# Altium schematic sheet Optical Compressor V2.SchDoc (part 1 of 2)
size A2; SheetNumber: 1; SheetTotal: 1
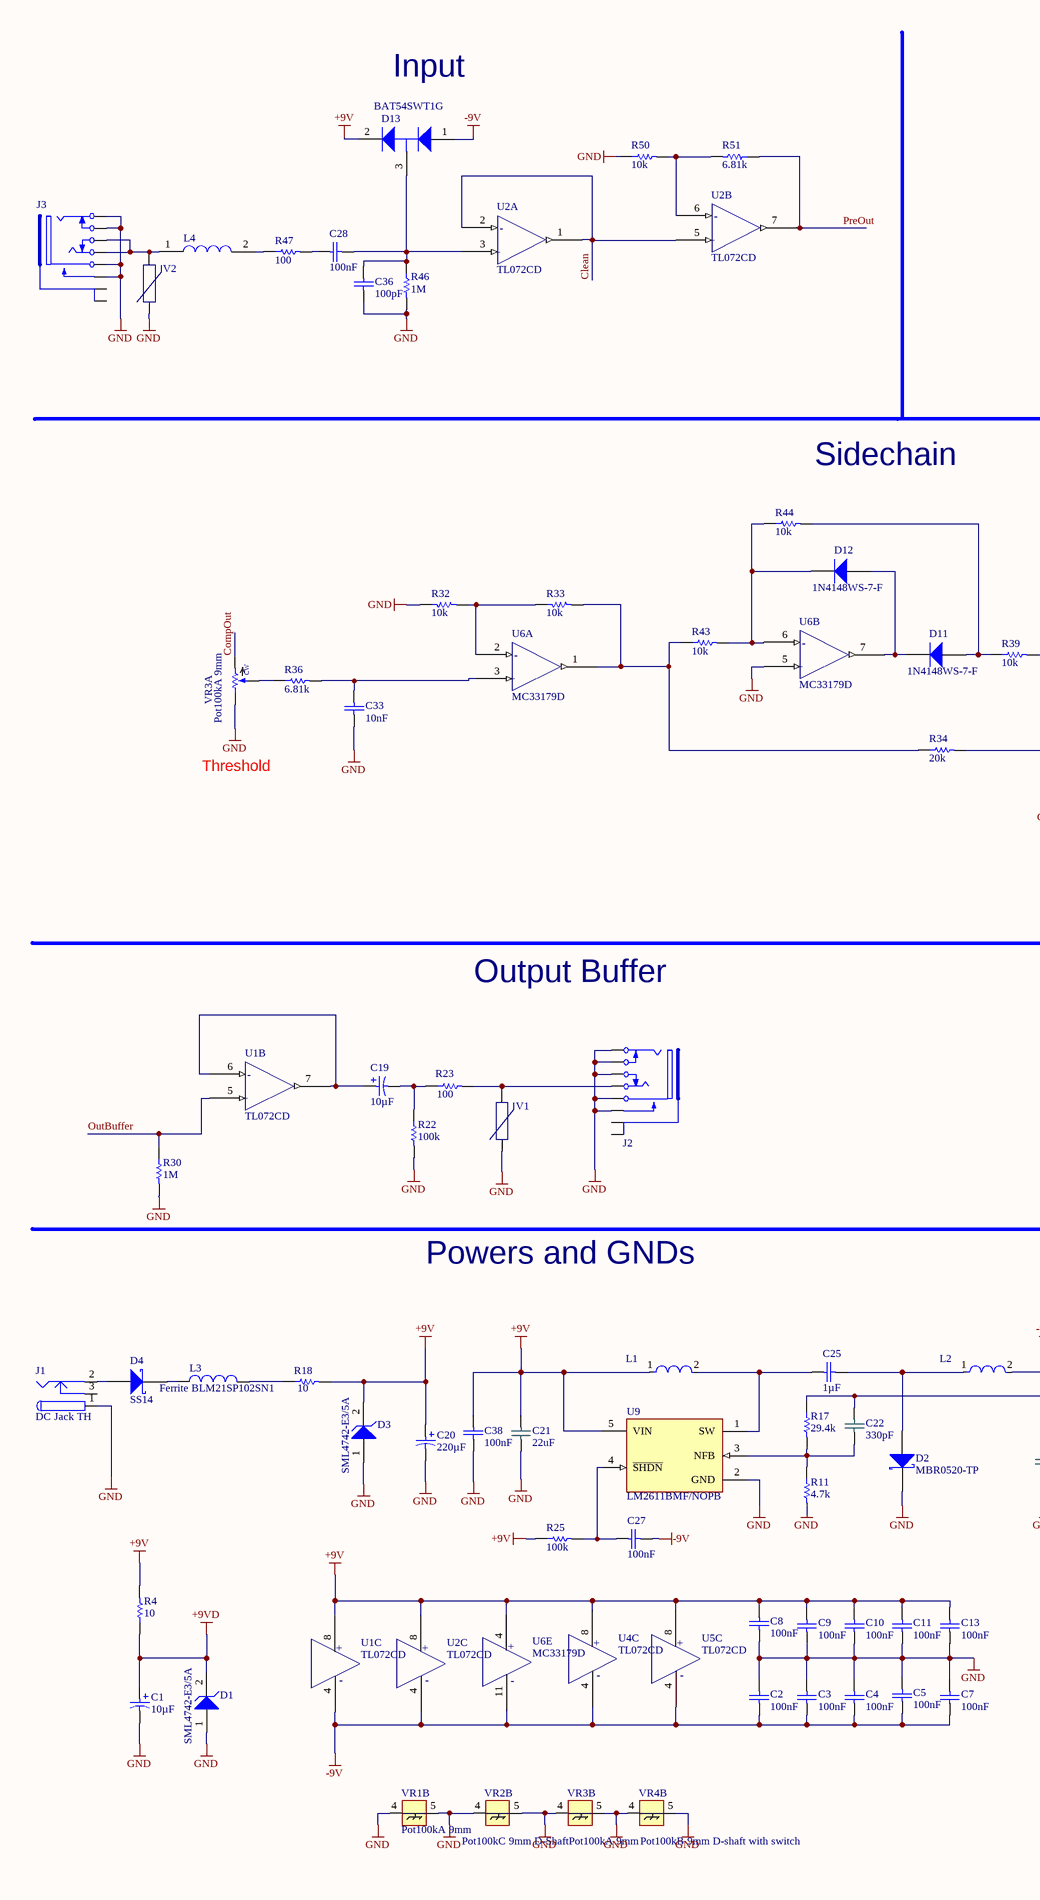
[diagram p0: Optical Compressor V2.SchDoc, left]
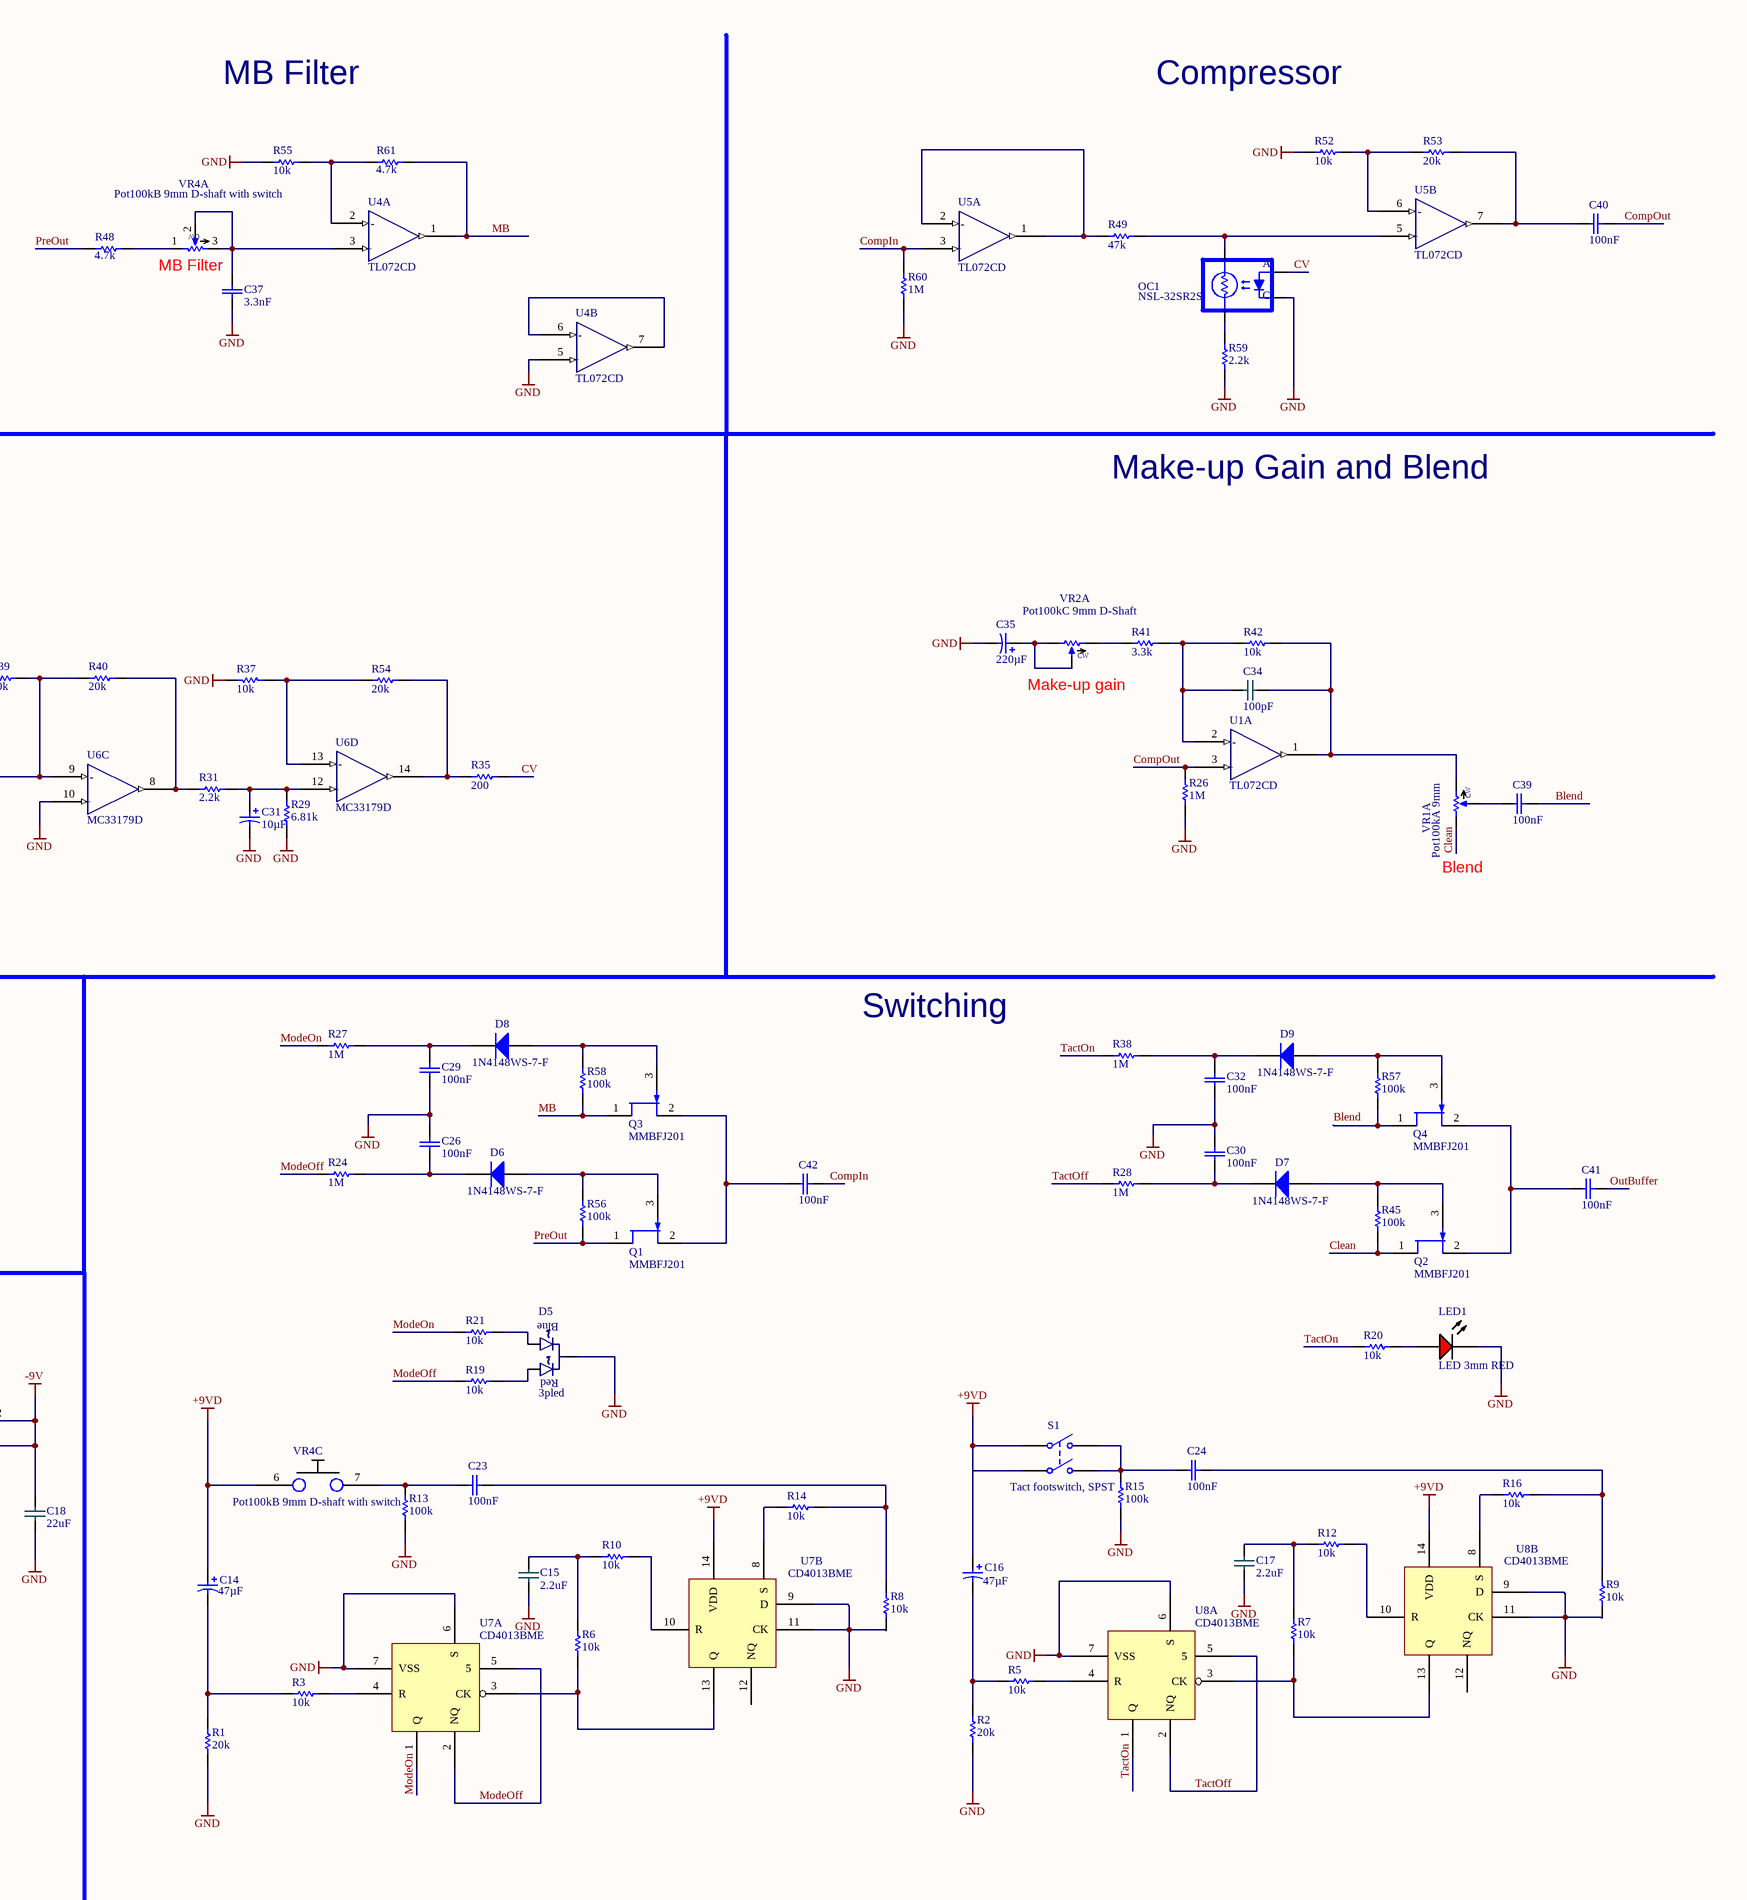
[diagram p1: Optical Compressor V2.SchDoc, right]

## Parts
C1  Capacitance: 10µF  [E-CAP, SMT, diameter 5mm, height 5.4mm]  (hidden comment: Cap pol 10µF 35V)
C2  Capacitance: 100nF  [0603-CAP]  (hidden comment: Cap 100nF 0603 X7R)
C3  Capacitance: 100nF  [0603-CAP]  (hidden comment: Cap 100nF 0603 X7R)
C4  Capacitance: 100nF  [0603-CAP]  (hidden comment: Cap 100nF 0603 X7R)
C5  Capacitance: 100nF  [0603-CAP]  (hidden comment: Cap 100nF 0603 X7R)
C7  Capacitance: 100nF  [0603-CAP]  (hidden comment: Cap 100nF 0603 X7R)
C8  Capacitance: 100nF  [0603-CAP]  (hidden comment: Cap 100nF 0603 X7R)
C9  Capacitance: 100nF  [0603-CAP]  (hidden comment: Cap 100nF 0603 X7R)
C10  Capacitance: 100nF  [0603-CAP]  (hidden comment: Cap 100nF 0603 X7R)
C11  Capacitance: 100nF  [0603-CAP]  (hidden comment: Cap 100nF 0603 X7R)
C13  Capacitance: 100nF  [0603-CAP]  (hidden comment: Cap 100nF 0603 X7R)
C14  Capacitance: 47µF  [E-CAP, SMT, diameter 6.3mm, height 5.4mm]  (hidden comment: Cap pol 47µF 16V)
C15  Capacitance: 2.2uF  [0805-CAP]  (hidden comment: Cap 0805 2.2uF)
C16  Capacitance: 47µF  [E-CAP, SMT, diameter 6.3mm, height 5.4mm]  (hidden comment: Cap pol 47µF 16V)
C17  Capacitance: 2.2uF  [0805-CAP]  (hidden comment: Cap 0805 2.2uF)
C18  value 22uF  [0805-CAP]  (hidden comment: Cap 0805 22uF)
C19  Capacitance: 10µF  [E-CAP, SMT, diameter 5mm, height 5.4mm]  (hidden comment: Cap pol 10µF 35V)
C20  Capacitance: 220µF  [E-CAP, SMT, diameter 6.3mm, height 7.7mm]  (hidden comment: Cap pol 220µF 16V)
C21  value 22uF  [0805-CAP]  (hidden comment: Cap 0805 22uF)
C22  value 330pF  [0603-CAP]  (hidden comment: Cap 0603 330pF)
C23  Capacitance: 100nF  [0603-CAP]  (hidden comment: Cap 100nF 0603 X7R)
C24  Capacitance: 100nF  [0603-CAP]  (hidden comment: Cap 100nF 0603 X7R)
C25  Capacitance: 1µF  [0805-CAP]  (hidden comment: Cap 1µF 0805 X7R)
C26  Capacitance: 100nF  [0603-CAP]  (hidden comment: Cap 100nF 0603 X7R)
C27  Capacitance: 100nF  [0603-CAP]  (hidden comment: Cap 100nF 0603 X7R)
C28  Capacitance: 100nF  [1206-CAP]  (hidden comment: Cap 100nF 1206 C0G)
C29  Capacitance: 100nF  [0603-CAP]  (hidden comment: Cap 100nF 0603 X7R)
C30  Capacitance: 100nF  [0603-CAP]  (hidden comment: Cap 100nF 0603 X7R)
C31  Capacitance: 10µF  [E-CAP, SMT, diameter 5mm, height 5.4mm]  (hidden comment: Cap pol 10µF 35V)
C32  Capacitance: 100nF  [0603-CAP]  (hidden comment: Cap 100nF 0603 X7R)
C33  Capacitance: 10nF  [0603-CAP]  (hidden comment: Cap 10nF 0603 C0G)
C34  Capacitance: 100pF  [0603-CAP]  (hidden comment: Cap 0603 100pF)
C35  Capacitance: 220µF  [E-CAP, SMT, diameter 6.3mm, height 7.7mm]  (hidden comment: Cap pol 220µF 16V)
C36  Capacitance: 100pF  [0603-CAP]  (hidden comment: Cap 100pF 0603 C0G)
C37  Capacitance: 3.3nF  [0603-CAP]  (hidden comment: Cap 3.3nF 0603 C0G)
C38  Capacitance: 100nF  [0603-CAP]  (hidden comment: Cap 100nF 0603 X7R)
C39  Capacitance: 100nF  [1206-CAP]  (hidden comment: Cap 100nF 1206 C0G)
C40  Capacitance: 100nF  [1206-CAP]  (hidden comment: Cap 100nF 1206 C0G)
C41  Capacitance: 100nF  [1206-CAP]  (hidden comment: Cap 100nF 1206 C0G)
C42  Capacitance: 100nF  [1206-CAP]  (hidden comment: Cap 100nF 1206 C0G)
D1  SML4742-E3/5A  [DO-214AC]
D2  MBR0520-TP  [SODFL370X135-2N]
D3  SML4742-E3/5A  [DO-214AC]
D4  SS14  [SS14]
D5  3pled  [LED DUAL REDBLUE]
D6  1N4148WS-7-F  [1N4148WS-7-F]
D7  1N4148WS-7-F  [1N4148WS-7-F]
D8  1N4148WS-7-F  [1N4148WS-7-F]
D9  1N4148WS-7-F  [1N4148WS-7-F]
D11  1N4148WS-7-F  [1N4148WS-7-F]
D12  1N4148WS-7-F  [1N4148WS-7-F]
D13  BAT54SWT1G  [ONSC-SOT-323-3-419-04_V]
J1  DC Jack TH  [DC_Jack]
J2  Neutrik TRS Jack with metal nut  [Neutrik Jack with Cliff EMI screen]  (value not drawn)
J3  Neutrik TRS Jack with metal nut  [Neutrik Jack with Cliff EMI screen]  (value not drawn)
L1  CR32NP-100KC  [INDC3340X27N]  (value not drawn)
L2  CR32NP-100KC  [INDC3340X27N]  (value not drawn)
L3  Ferrite BLM21SP102SN1  [0805-IND]
L4  MAF1005GAD352A  [0402 COMPONENT]  (value not drawn)
LED1  LED 3mm RED  [KING-WP710A10QBCD_V]
OC1  NSL-32SR2S  [NSL]
Q1  MMBFJ201  [MMBFJ201]
Q2  MMBFJ201  [MMBFJ201]
Q3  MMBFJ201  [MMBFJ201]
Q4  MMBFJ201  [MMBFJ201]
R1  Resistance: 20k  [0603-RES]  (hidden comment: Res 20k 1% 0603)
R2  Resistance: 20k  [0603-RES]  (hidden comment: Res 20k 1% 0603)
R3  Resistance: 10k  [0603-RES]  (hidden comment: Res 10k 1% 0603)
R4  Resistance: 10  [0805-RES]  (hidden comment: Res 10R 5% 0805)
R5  Resistance: 10k  [0603-RES]  (hidden comment: Res 10k 1% 0603)
R6  Resistance: 10k  [0603-RES]  (hidden comment: Res 10k 1% 0603)
R7  Resistance: 10k  [0603-RES]  (hidden comment: Res 10k 1% 0603)
R8  Resistance: 10k  [0603-RES]  (hidden comment: Res 10k 1% 0603)
R9  Resistance: 10k  [0603-RES]  (hidden comment: Res 10k 1% 0603)
R10  Resistance: 10k  [0603-RES]  (hidden comment: Res 10k 1% 0603)
R11  Resistance: 4.7k  [0603-RES]  (hidden comment: Res 4.7k 1% 0603)
R12  Resistance: 10k  [0603-RES]  (hidden comment: Res 10k 1% 0603)
R13  Resistance: 100k  [0603-RES]  (hidden comment: Res 100k 1% 0603)
R14  Resistance: 10k  [0603-RES]  (hidden comment: Res 10k 1% 0603)
R15  Resistance: 100k  [0603-RES]  (hidden comment: Res 100k 1% 0603)
R16  Resistance: 10k  [0603-RES]  (hidden comment: Res 10k 1% 0603)
R17  Resistance: 29.4k  [0805-RES]  (hidden comment: Res 29.4k 1% 0805)
R18  Resistance: 10  [0805-RES]  (hidden comment: Res 10R 5% 0805)
R19  Resistance: 10k  [0603-RES]  (hidden comment: Res 10k 1% 0603)
R20  Resistance: 10k  [0603-RES]  (hidden comment: Res 10k 1% 0603)
R21  Resistance: 10k  [0603-RES]  (hidden comment: Res 10k 1% 0603)
R22  Resistance: 100k  [0603-RES]  (hidden comment: Res 100k 1% 0603)
R23  Resistance: 100  [0805-RES]  (hidden comment: Res 100R 1% 0805)
R24  Resistance: 1M  [0603-RES]  (hidden comment: Res 1M 1% 0603)
R25  Resistance: 100k  [0603-RES]  (hidden comment: Res 100k 1% 0603)
R26  Resistance: 1M  [0603-RES]  (hidden comment: Res 1M 1% 0603)
R27  Resistance: 1M  [0603-RES]  (hidden comment: Res 1M 1% 0603)
R28  Resistance: 1M  [0603-RES]  (hidden comment: Res 1M 1% 0603)
R29  Resistance: 6.81k  [0603-RES]  (hidden comment: Res 6.81k 1% 0603)
R30  Resistance: 1M  [0603-RES]  (hidden comment: Res 1M 1% 0603)
R31  Resistance: 2.2k  [0603-RES]  (hidden comment: Res 2.2k 1% 0603)
R32  Resistance: 10k  [0603-RES]  (hidden comment: Res 10k 1% 0603)
R33  Resistance: 10k  [0603-RES]  (hidden comment: Res 10k 1% 0603)
R34  Resistance: 20k  [0603-RES]  (hidden comment: Res 20k 1% 0603)
R35  Resistance: 200  [0805-RES]  (hidden comment: Res 200R 1% 0805)
R36  Resistance: 6.81k  [0603-RES]  (hidden comment: Res 6.81k 1% 0603)
R37  Resistance: 10k  [0603-RES]  (hidden comment: Res 10k 1% 0603)
R38  Resistance: 1M  [0603-RES]  (hidden comment: Res 1M 1% 0603)
R39  Resistance: 10k  [0603-RES]  (hidden comment: Res 10k 1% 0603)
R40  Resistance: 20k  [0603-RES]  (hidden comment: Res 20k 1% 0603)
R41  Resistance: 3.3k  [0603-RES]  (hidden comment: Res 3.3k 1% 0603)
R42  Resistance: 10k  [0603-RES]  (hidden comment: Res 10k 1% 0603)
R43  Resistance: 10k  [0603-RES]  (hidden comment: Res 10k 1% 0603)
R44  Resistance: 10k  [0603-RES]  (hidden comment: Res 10k 1% 0603)
R45  Resistance: 100k  [0603-RES]  (hidden comment: Res 100k 1% 0603)
R46  Resistance: 1M  [0603-RES]  (hidden comment: Res 1M 1% 0603)
R47  Resistance: 100  [0805-RES]  (hidden comment: Res 100R 1% 0805)
R48  Resistance: 4.7k  [0603-RES]  (hidden comment: Res 4.7k 1% 0603)
R49  Resistance: 47k  [0603-RES]  (hidden comment: Res 47k 1% 0603)
R50  Resistance: 10k  [0603-RES]  (hidden comment: Res 10k 1% 0603)
R51  Resistance: 6.81k  [0603-RES]  (hidden comment: Res 6.81k 1% 0603)
R52  Resistance: 10k  [0603-RES]  (hidden comment: Res 10k 1% 0603)
R53  Resistance: 20k  [0603-RES]  (hidden comment: Res 20k 1% 0603)
R54  Resistance: 20k  [0603-RES]  (hidden comment: Res 20k 1% 0603)
R55  Resistance: 10k  [0603-RES]  (hidden comment: Res 10k 1% 0603)
R56  Resistance: 100k  [0603-RES]  (hidden comment: Res 100k 1% 0603)
R57  Resistance: 100k  [0603-RES]  (hidden comment: Res 100k 1% 0603)
R58  Resistance: 100k  [0603-RES]  (hidden comment: Res 100k 1% 0603)
R59  Resistance: 2.2k  [0603-RES]  (hidden comment: Res 2.2k 1% 0603)
R60  Resistance: 1M  [0603-RES]  (hidden comment: Res 1M 1% 0603)
R61  Resistance: 4.7k  [0603-RES]  (hidden comment: Res 4.7k 1% 0603)
S1  Tact footswitch, SPST  [Tact-SKHCBEA010]
U1  TL072CD  [SOIC8-127P600X175-8N]  (parts A,B,C of 3)
U2  TL072CD  [SOIC8-127P600X175-8N]  (parts A,B,C of 3)
U4  TL072CD  [SOIC8-127P600X175-8N]  (parts A,B,C of 3)
U5  TL072CD  [SOIC8-127P600X175-8N]  (parts A,B,C of 3)
U6  MC33179D  [SOIC14-127P600X175-14N]  (parts A,B,C,D,E of 5)
U7  CD4013BME  [SOIC14-127P600X175-14N]  (parts A,B of 2)
U8  CD4013BME  [SOIC14-127P600X175-14N]  (parts A,B of 2)
U9  LM2611BMF/NOPB  [DBV0005A_M]
V1  Var AVRF101U6R8KT242  [0402 COMPONENT]  (value not drawn)
V2  Var AVRF101U6R8KT242  [0402 COMPONENT]  (value not drawn)
VR1  Pot100kA 9mm  [LJV 9mm pot]  (parts A,B of 2)
VR2  Pot100kC 9mm D-Shaft  [LJV 9mm pot]  (parts A,B of 2)
VR3  Pot100kA 9mm  [LJV 9mm pot]  (parts A,B of 2)
VR4  Pot100kB 9mm D-shaft with switch  [LJV 9mm pot with switch]  (parts A,B,C of 3)

## Nets
+9V: C8.1 C9.2 C10.2 C11.2 C13.2 C20.1 C21.2 C38.1 D3.2 D13.2(K) L1.1 R4.2 R18.2 R25.1 U1.8(V+) U2.8(V+) U4.8(V+) U5.8(V+) U6.4 U9.5(VIN)
+9VD: C1.1 C14.1 C16.1 D1.2 R4.1 S1.1(COMMON1) S1.2(COMMON2) U7.14(VDD) U8.14(VDD) VR4.6(SW1)
-9V: C2.1 C3.1 C4.1 C5.1 C7.1 C18.2 C22.1 C27.2 D13.1(A) L2.2 R17.1 U1.4(V-) U2.4(V-) U4.4(V-) U5.4(V-) U6.11
GND: C1.2 C2.2 C3.2 C4.2 C5.2 C7.2 C8.2 C9.1 C10.1 C11.1 C13.1 C15.2 C17.2 C18.1 C20.2 C21.1 C26.2 C29.1 C30.2 C31.2 C32.1 C33.2 C35.2 C36.2 C37.2 C38.2 D1.1 D2.2(K) D3.1 D5.2 J1.1 J2.1 J2.2 J2.4 J2.5 J2.6 J3.1 J3.2 J3.5 J3.6 LED1.2(K) OC1.K(C) R1.1 R2.1 R8.1 R9.1 R11.2 R13.2 R15.2 R22.2 R26.2 R29.1 R30.2 R32.1 R37.1 R46.2 R50.1 R52.1 R55.1 R59.1 R60.2 U4.5(IN+) U6.5 U6.10 U7.6(S) U7.7(VSS) U7.9(D) U7.11(CK) U8.6(S) U8.7(VSS) U8.9(D) U8.11(CK) U9.2(GND) V1.1 V2.1 VR1.4 VR1.5 VR2.4 VR2.5 VR3.1(CCWPIN) VR3.4 VR3.5 VR4.4 VR4.5
Blend: C39.2 Q4.1(D) R57.2
Clean: Q2.1(D) R45.2 U2.1(OUT) U2.2(IN-) U2.5(IN+) VR1.1(CCWPIN)
CompIn: C42.2 R60.1 U5.3(IN+)
CompOut: C40.2 R26.1 U1.3(IN+) VR3.3(CWPIN)
CV: OC1.A R35.1
MB: Q3.1(D) R58.2 R61.2 U4.1(OUT)
ModeOff: R19.2 R24.1 U7.2(NQ) U7.5
ModeOn: R21.2 R27.1 U7.1(Q)
OutBuffer: C41.2 R30.1 U1.5(IN+)
PreOut: Q1.1(D) R48.1 R51.1 R56.2 U2.7
TactOff: R28.1 U8.2(NQ) U8.5
TactOn: R20.2 R38.1 U8.1(Q)
NetC14_2: C14.2 R1.2 R3.2
NetC15_1: C15.1 R6.1 R10.1
NetC16_2: C16.2 R2.2 R5.2
NetC17_1: C17.1 R7.1 R12.1
NetC19_1: C19.1 U1.6(IN-) U1.7
NetC19_2: C19.2 R22.1 R23.1
NetC22_2: C22.2 R11.1 R17.2 U9.3(NFB)
NetC23_1: C23.1 R13.1 VR4.7(SW2)
NetC23_2: C23.2 R8.2 R14.2
NetC24_1: C24.1 R15.1 S1.3(NO1) S1.4(NO2)
NetC24_2: C24.2 R9.2 R16.2
NetC25_1: C25.1 L1.2 U9.1(SW)
NetC25_2: C25.2 D2.1(A) L2.1
NetC26_1: C26.1 D6.2(K) R24.2
NetC27_1: C27.1 R25.2 U9.4(~{SHDN})
NetC28_1: C28.1 R47.2
NetC28_2: C28.2 C36.1 D13.3(K/A) R46.1 U2.3(IN+)
NetC29_2: C29.2 D8.2(K) R27.2
NetC30_1: C30.1 D7.2(K) R28.2
NetC31_1: C31.1 R29.2 R31.2 U6.12
NetC32_2: C32.2 D9.2(K) R38.2
NetC33_1: C33.1 R36.2 U6.3
NetC34_1: C34.1 R41.2 R42.1 U1.2(IN-)
NetC34_2: C34.2 R42.2 U1.1(OUT) VR1.3(CWPIN)
NetC35_1: C35.1 VR2.1(CCWPIN) VR2.2(WIPER)
NetC37_1: C37.1 U4.3(IN+) VR4.2(WIPER) VR4.3(CWPIN)
NetC39_1: C39.1 VR1.2(WIPER)
NetC40_1: C40.1 R53.2 U5.7
NetC41_1: C41.1 Q2.2(S) Q4.2(S)
NetC42_1: C42.1 Q1.2(S) Q3.2(S)
NetD4_A: D4.A J1.2
NetD4_K: D4.K L3.1
NetD5_1: D5.1 R21.1
NetD5_3: D5.3 R19.1
NetD6_1: D6.1(A) Q1.3(G) R56.1
NetD7_1: D7.1(A) Q2.3(G) R45.1
NetD8_1: D8.1(A) Q3.3(G) R58.1
NetD9_1: D9.1(A) Q4.3(G) R57.1
NetD11_1: D11.1(A) R39.1 R44.2
NetD11_2: D11.2(K) D12.1(A) U6.7
NetD12_2: D12.2(K) R43.2 R44.1 U6.6
NetJ2_3: J2.3 R23.2 V1.2
NetJ3_3: J3.3 J3.4 L4.1 V2.2
NetL3_2: L3.2 R18.1
NetL4_2: L4.2 R47.1
NetLED1_1: LED1.1(A) R20.1
NetOC1_C1: OC1.C1(PC1) R49.2 U5.5(IN+)
NetOC1_C2: OC1.C2(PC2) R59.2
NetR3_1: R3.1 U7.4(R)
NetR5_1: R5.1 U8.4(R)
NetR6_2: R6.2 U7.3(CK) U7.13(Q)
NetR7_2: R7.2 U8.3(CK) U8.13(Q)
NetR10_2: R10.2 U7.10(R)
NetR12_2: R12.2 U8.10(R)
NetR14_1: R14.1 U7.8(S)
NetR16_1: R16.1 U8.8(S)
NetR31_1: R31.1 R40.2 U6.8
NetR32_2: R32.2 R33.1 U6.2
NetR33_2: R33.2 R34.1 R43.1 U6.1
NetR34_2: R34.2 R39.2 R40.1 U6.9
NetR35_2: R35.2 R54.2 U6.14
NetR36_1: R36.1 VR3.2(WIPER)
NetR37_2: R37.2 R54.1 U6.13
NetR41_1: R41.1 VR2.3(CWPIN)
NetR48_2: R48.2 VR4.1(CCWPIN)
NetR49_1: R49.1 U5.1(OUT) U5.2(IN-)
NetR50_2: R50.2 R51.2 U2.6(IN-)
NetR52_2: R52.2 R53.1 U5.6(IN-)
NetR55_2: R55.2 R61.1 U4.2(IN-)
NetU4_6: U4.6(IN-) U4.7

Not connected (* = marked no-connect by the designer): J1 3; J2 7 8; J3 7 8; U7 12(NQ); U8 12(NQ)

## Notes on the sheet
- Input
- MB Filter
- Compressor
- Sidechain
- Make-up Gain and Blend
- Make-up gain
- Threshold
- Blend
- Output Buffer
- Switching
- Powers and GNDs
- (in symbol CMP-028-0012-7, part A) -; +
- (in symbol CMP-028-0012-7, part B) -; +
- (in symbol CMP-028-0012-7, part C) +; -
- (in symbol CMP-028-0019-6, part A) -; +
- (in symbol CMP-028-0019-6, part B) -; +
- (in symbol CMP-028-0019-6, part C) -; +
- (in symbol CMP-028-0019-6, part D) -; +
- (in symbol CMP-028-0019-6, part E) +; -
- (in symbol CMP-028-0051-1, part A) CW
- (in symbol CMP-028-0051-2, part A) CW
- (in symbol CMP-029-0001-5) Blue; Red
- (in symbol CMP-04127-2, part A) CW
- (in symbol CMP-04321-1, part A) CW